# EAGLE schematic V1_Layout (EAGLE 9.2.2)
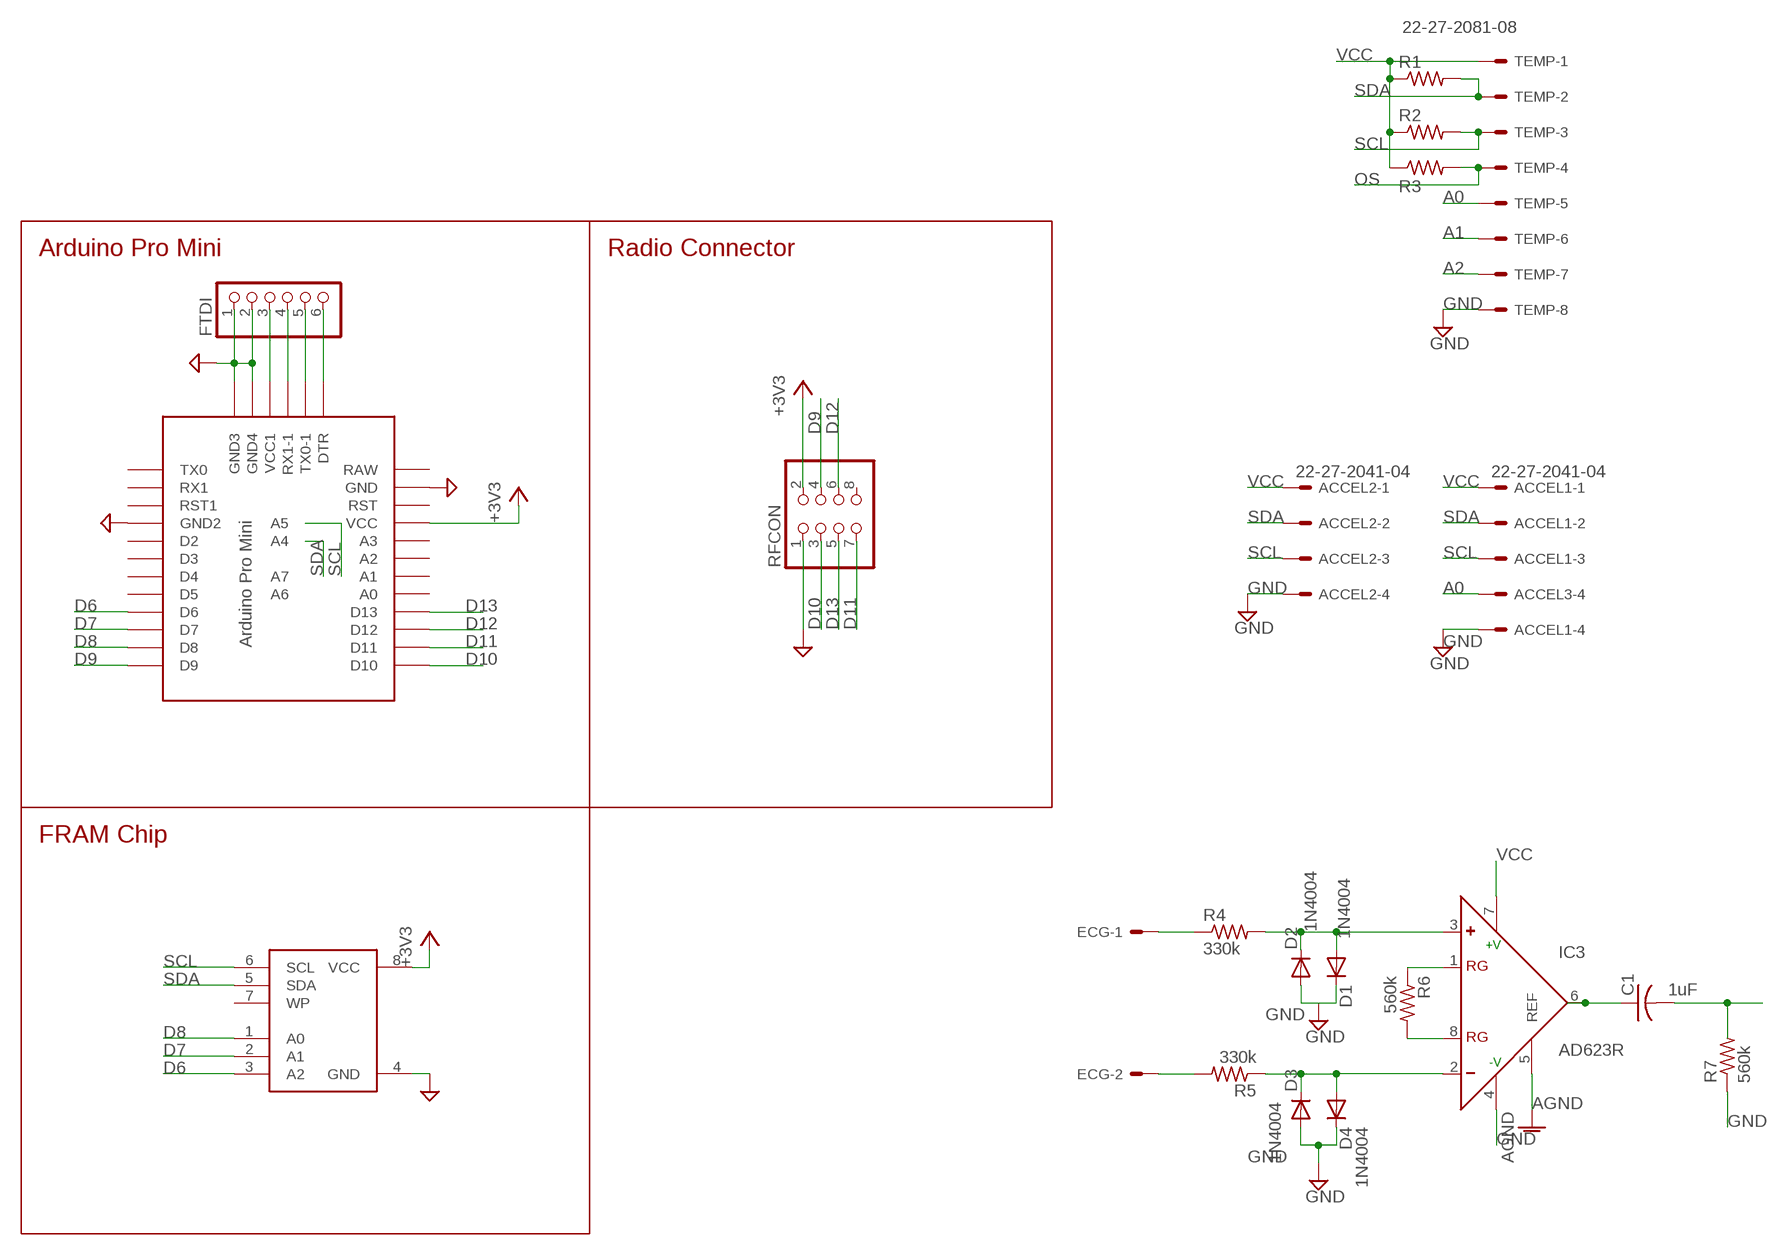
[diagram p0: schematic, sheet 1]

## Parts
ACCEL1  22-27-2041-04  [6410-04]
ACCEL2  22-27-2041-04  [6410-04]
ACCEL3  22-27-2041-04  [6410-04]
C1  1uF  C-USC0805  [C0805]
D1  1N4004  [DO41-10]
D2  1N4004  [DO41-10]
D3  1N4004  [DO41-10]
D4  1N4004  [DO41-10]
ECG  22-27-2021-02  [6410-02]
FTDI  PINHD-1X6  [1X06]
IC3  AD623R  [SO8]
R1  R-US_R0805  [R0805]
R2  R-US_R0805  [R0805]
R3  R-US_R0805  [R0805]
R4  330k  R-US_R0805  [R0805]
R5  330k  R-US_R0805  [R0805]
R6  560k  R-US_R0805  [R0805]
R7  560k  R-US_R0805  [R0805]
RFCON  PINHD-2X4  [2X04]
TEMP  22-27-2081-08  [6410-08]
U2  MB85RC256VPF-G-JNERE2  [SOIC8]
U$1  PRO-MINI-2  [PRO-MINI-2]

## Nets
+3V3: RFCON.2 U2.8(VCC) U$1.VCC
A0: ACCEL3.4 TEMP.5
A1: TEMP.6
A2: TEMP.7
AGND: IC3.5(REF)
D6: U2.3(A2) U$1.D6
D7: U2.2(A1) U$1.D7
D8: U2.1(A0) U$1.D8
D9: RFCON.4 U$1.D9
D10: RFCON.3 U$1.D10
D11: RFCON.7 U$1.D11
D12: RFCON.6 U$1.D12
D13: RFCON.5 U$1.D13
GND: ACCEL1.4 ACCEL2.4 C1.2 D1.C D2.A D3.A D4.C FTDI.1 FTDI.2 IC3.4(-V) R7.1 R7.2 RFCON.1 TEMP.8 U2.4(GND) U$1.GND U$1.GND1(GND2) U$1.GND2(GND3) U$1.GND3(GND4)
N$1: ECG.1 R4.1
N$2: D3.C D4.A IC3.2(-) R5.1
N$4: ECG.2 R5.2
N$5: D1.A D2.C IC3.3(+) R4.2
N$6: C1.1 IC3.6(OUT)
N$7: IC3.8(RG) R6.2
N$8: IC3.1(RG) R6.1
N$12: FTDI.6 U$1.DTR
N$13: FTDI.5 U$1.TX0-1
N$14: FTDI.4 U$1.RX1-1
N$15: FTDI.3 U$1.VCC1
OS: R3.2 TEMP.4
SCL: ACCEL1.3 ACCEL2.3 R2.2 TEMP.3 U2.6(SCL) U$1.A5
SDA: ACCEL1.2 ACCEL2.2 R1.2 TEMP.2 U2.5(SDA) U$1.A4
VCC: ACCEL1.1 ACCEL2.1 IC3.7(+V) R1.1 R2.1 R3.1 TEMP.1
Unconnected: ACCEL3.1 ACCEL3.2 ACCEL3.3 RFCON.8 U2.7(WP) U$1.A0 U$1.A1 U$1.A2 U$1.A3 U$1.A6 U$1.A7 U$1.D2 U$1.D3 U$1.D4 U$1.D5 U$1.RAW U$1.RST U$1.RST1 U$1.RX1 U$1.TX0

## Notes on the sheet
- Arduino Pro Mini | Radio Connector
- FRAM Chip

## Library data of the parts
ACCEL1-ACCEL3 = con-molex:22-?-04: CONNECTOR wire to board 2.54 mm (.1 inch) pitch header; MF: MOLEX; OC_FARNELL: unknown; OC_NEWARK: unknown
C1 = rcl:C-US: CAPACITOR, American symbol; SPICEPREFIX: C
D1-D4 = diode:1N4004: DIODE general purpose rectifier, 1 A
ECG = con-molex:22-?-02: CONNECTOR wire to board 2.54 mm (.1 inch) pitch header; MF: MOLEX; OC_FARNELL: unknown; OC_NEWARK: unknown
FTDI = pinhead:PINHD-1X6: PIN HEADER
IC3 = analog-devices:AD623: Single-Supply, Rail-to-Rail, Low Cost Instrumentation Amplifier Source: http://www.analog.com/static/imported-files/data_sheets/AD623.pdf; MPN: AD623ARZ.; OC_FARNELL: 9426213; OC_NEWARK: 31M4186
R1-R7 = rcl:R-US_: RESISTOR, American symbol; SPICEPREFIX: R
RFCON = pinhead:PINHD-2X4: PIN HEADER
TEMP = con-molex:22-?-08: CONNECTOR wire to board 2.54 mm (.1 inch) pitch header; MF: MOLEX; OC_FARNELL: unknown; OC_NEWARK: unknown
U2 = Custom Parts:MB85RC256VPF-G-JNERE2
U$1 = Arduino-clone:PRO-MINI-2: Arduino Pro Mini Layout 2 Sparkfun.com